# Altium project Big Coil Bridge PCBA.PrjPCB
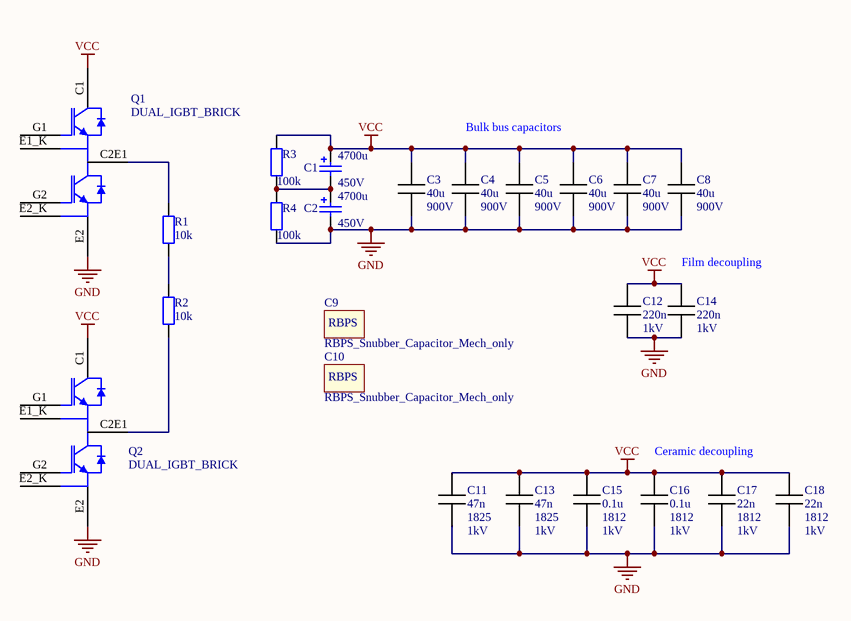
[diagram p0: Big Coil Bridge PCBA.SchDoc]
1 sheet, 24 parts. Net scope: global (net labels, ports and power ports of the same name join across sheets).
Board file: Big Coil Bridge PCBA_2.PcbDoc

## Sheet Big Coil Bridge PCBA.SchDoc
size A4

### Parts
C1  value 4700u  Voltage: 450V  [PEH200YV447BMB2]  (hidden comment: 885012209028)
C2  value 4700u  Voltage: 450V  [PEH200YV447BMB2]  (hidden comment: 885012209028)
C3  Capacitance: 40u  voltage: 900V  [C4AEOBW5400A3NJ]
C4  Capacitance: 40u  voltage: 900V  [C4AEOBW5400A3NJ]
C5  Capacitance: 40u  voltage: 900V  [C4AEOBW5400A3NJ]
C6  Capacitance: 40u  voltage: 900V  [C4AEOBW5400A3NJ]
C7  Capacitance: 40u  voltage: 900V  [C4AEOBW5400A3NJ]
C8  Capacitance: 40u  voltage: 900V  [C4AEOBW5400A3NJ]
C9  RBPS_Snubber_Capacitor_Mech_only  [RBPS_R4_OUTLINE]  (mechanical)
C10  RBPS_Snubber_Capacitor_Mech_only  [RBPS_R4_OUTLINE]  (mechanical)
C11  Capacitance: 47n  package: 1825  voltage: 1kV  [1825C]  (hidden comment: Capacitor)
C12  Capacitance: 220n  voltage: 1kV  [B32653A0224]  (hidden comment: Capacitor)
C13  Capacitance: 47n  package: 1825  voltage: 1kV  [1825C]  (hidden comment: Capacitor)
C14  Capacitance: 220n  voltage: 1kV  [B32653A0224]  (hidden comment: Capacitor)
C15  Capacitance: 0.1u  package: 1812  voltage: 1kV  [1812C]  (hidden comment: Capacitor)
C16  Capacitance: 0.1u  package: 1812  voltage: 1kV  [1812C]  (hidden comment: Capacitor)
C17  Capacitance: 22n  package: 1812  voltage: 1kV  [1812C]  (hidden comment: Capacitor)
C18  Capacitance: 22n  package: 1812  voltage: 1kV  [1812C]  (hidden comment: Capacitor)
Q1  DUAL_IGBT_BRICK  [CM300/SKM200_DUAL_FOOTPRINT_2]
Q2  DUAL_IGBT_BRICK  [CM300/SKM200_DUAL_FOOTPRINT_2]
R1  Parameter 1: 10k  [Res_Axial_0.6in]  (hidden comment: Resistor)
R2  Parameter 1: 10k  [Res_Axial_0.6in]  (hidden comment: Resistor)
R3  Parameter 1: 100k  [Res_Axial_0.6in]  (hidden comment: Resistor)
R4  Parameter 1: 100k  [Res_Axial_0.6in]  (hidden comment: Resistor)

### Nets
GND: C2.2(N) C3.2 C4.2 C5.2 C6.2 C7.2 C8.2 C11.2 C12.2 C13.2 C14.2 C15.2 C16.2 C17.2 C18.2 Q1.E2(E) Q2.E2(E) R4.1
VCC: C1.1(P) C3.1 C4.1 C5.1 C6.1 C7.1 C8.1 C11.1 C12.1 C13.1 C14.1 C15.1 C16.1 C17.1 C18.1 Q1.C1(C) Q2.C1(C) R3.2
NetC1_2: C1.2(N) C2.1(P) R3.1 R4.2
NetQ1_C2E1: Q1.C2E1 R1.2
NetQ2_C2E1: Q2.C2E1 R2.1
NetR1_1: R1.1 R2.2

Not connected (* = marked no-connect by the designer): Q1 E1_K(E) E2_K G1(G) G2(G); Q2 E1_K(E) E2_K G1(G) G2(G)

### Notes on the sheet
- Bulk bus capacitors
- (near C14) Film decoupling
- Ceramic decoupling
- (in symbol RBPS_Snubber_Capacitor_Mech_only) RBPS

### Library data of the parts
C1 C2 = Capacitor_Elec: Electrolytic capacitor; ComponentLink1Description: Manufacturer; ComponentLink1URL: http://www.we-online.de; ComponentLink2Description: Datasheet; ComponentLink2URL: http://katalog.we-online.com/pbs/datasheet/861101487033.pdf
C3-C8 = Capacitor: tolerance: *; type: *; material: *
Q1 Q2 = DUAL_IGBT_BRICK: IGBT, DUAL, BRICK
C11-C18 = Capacitor: tolerance: *; type: *; material: *
R1-R4 = Resistor: Power: *; Tolerance: *